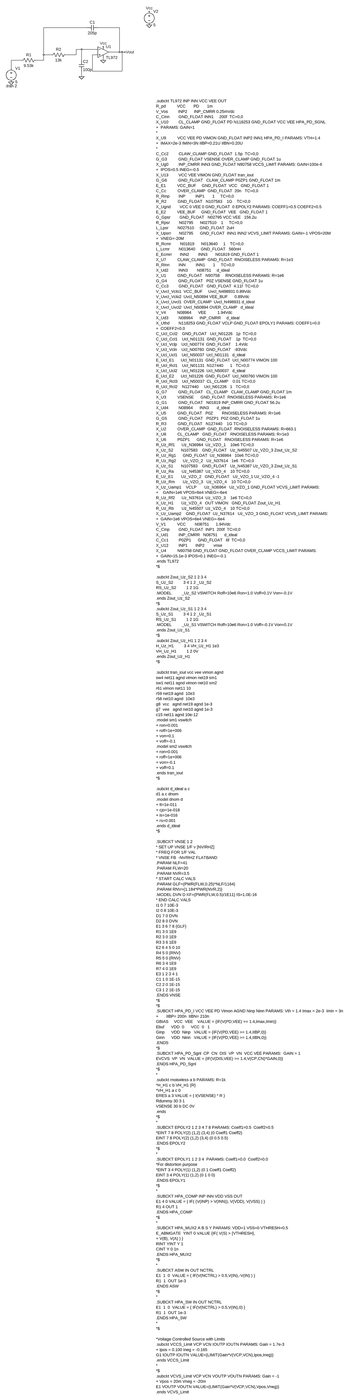
[diagram p0: schematic lowpass.asc, whole sheet]
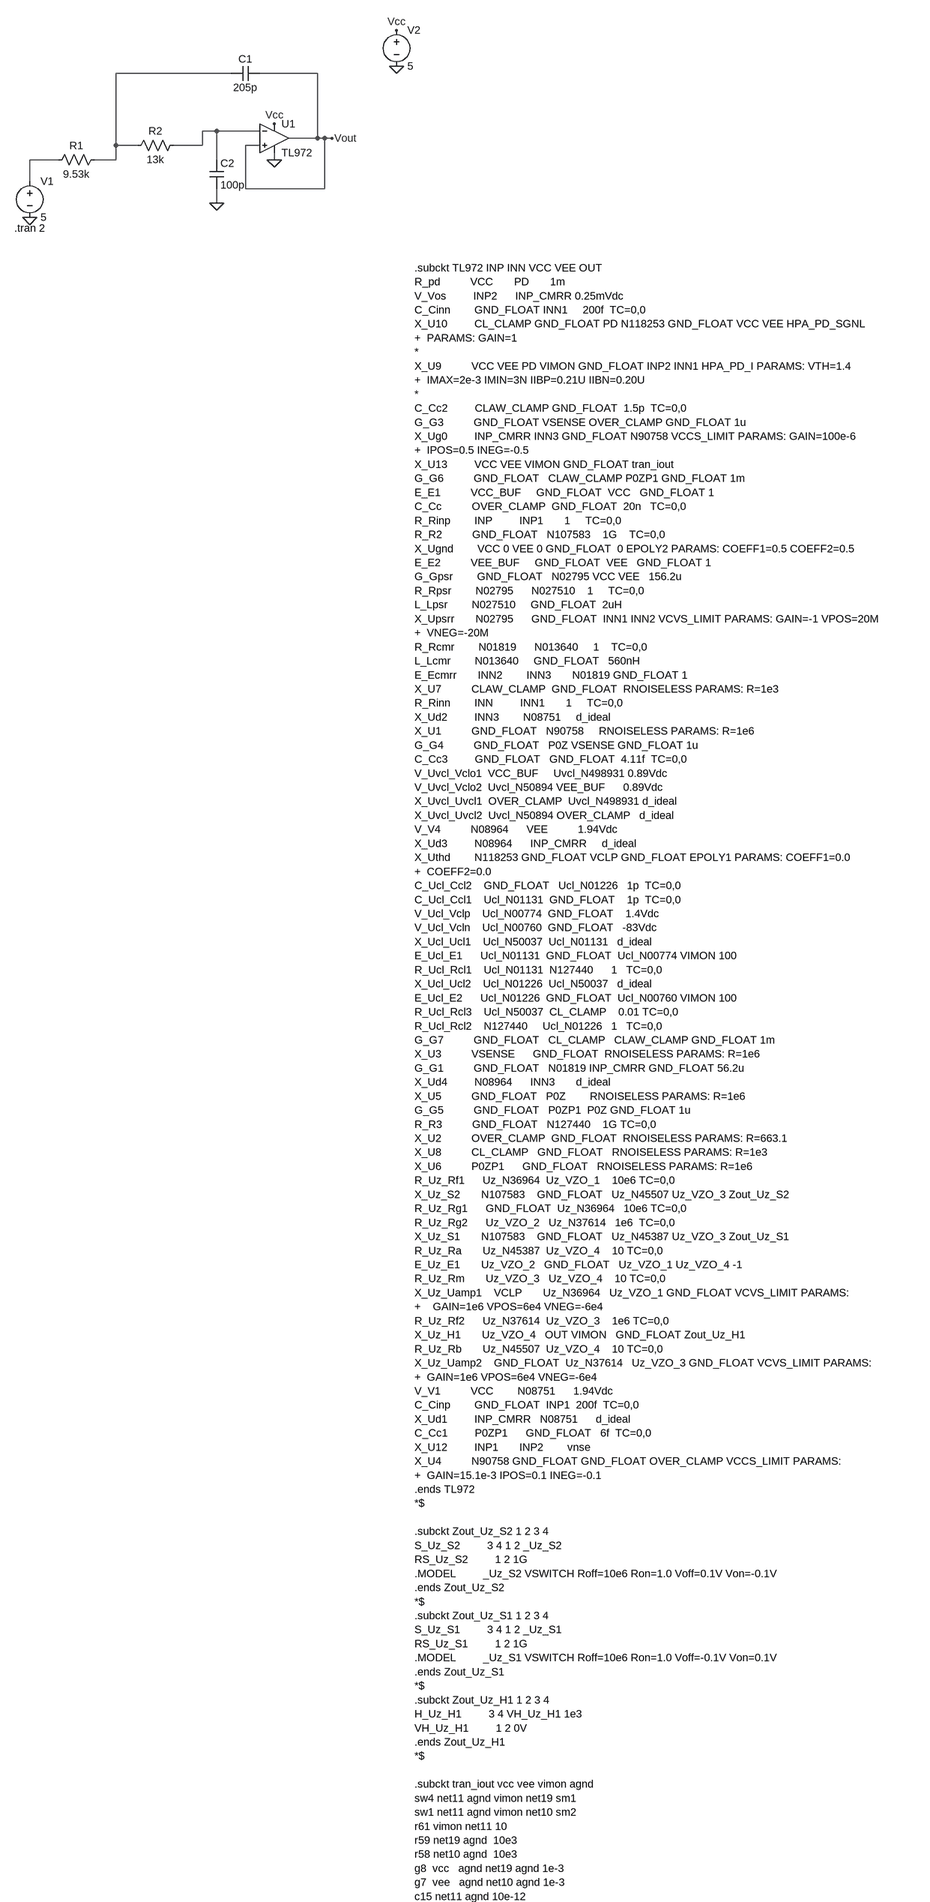
[diagram p1: schematic lowpass.asc, part, row 1 of 2, column 1 of 1]
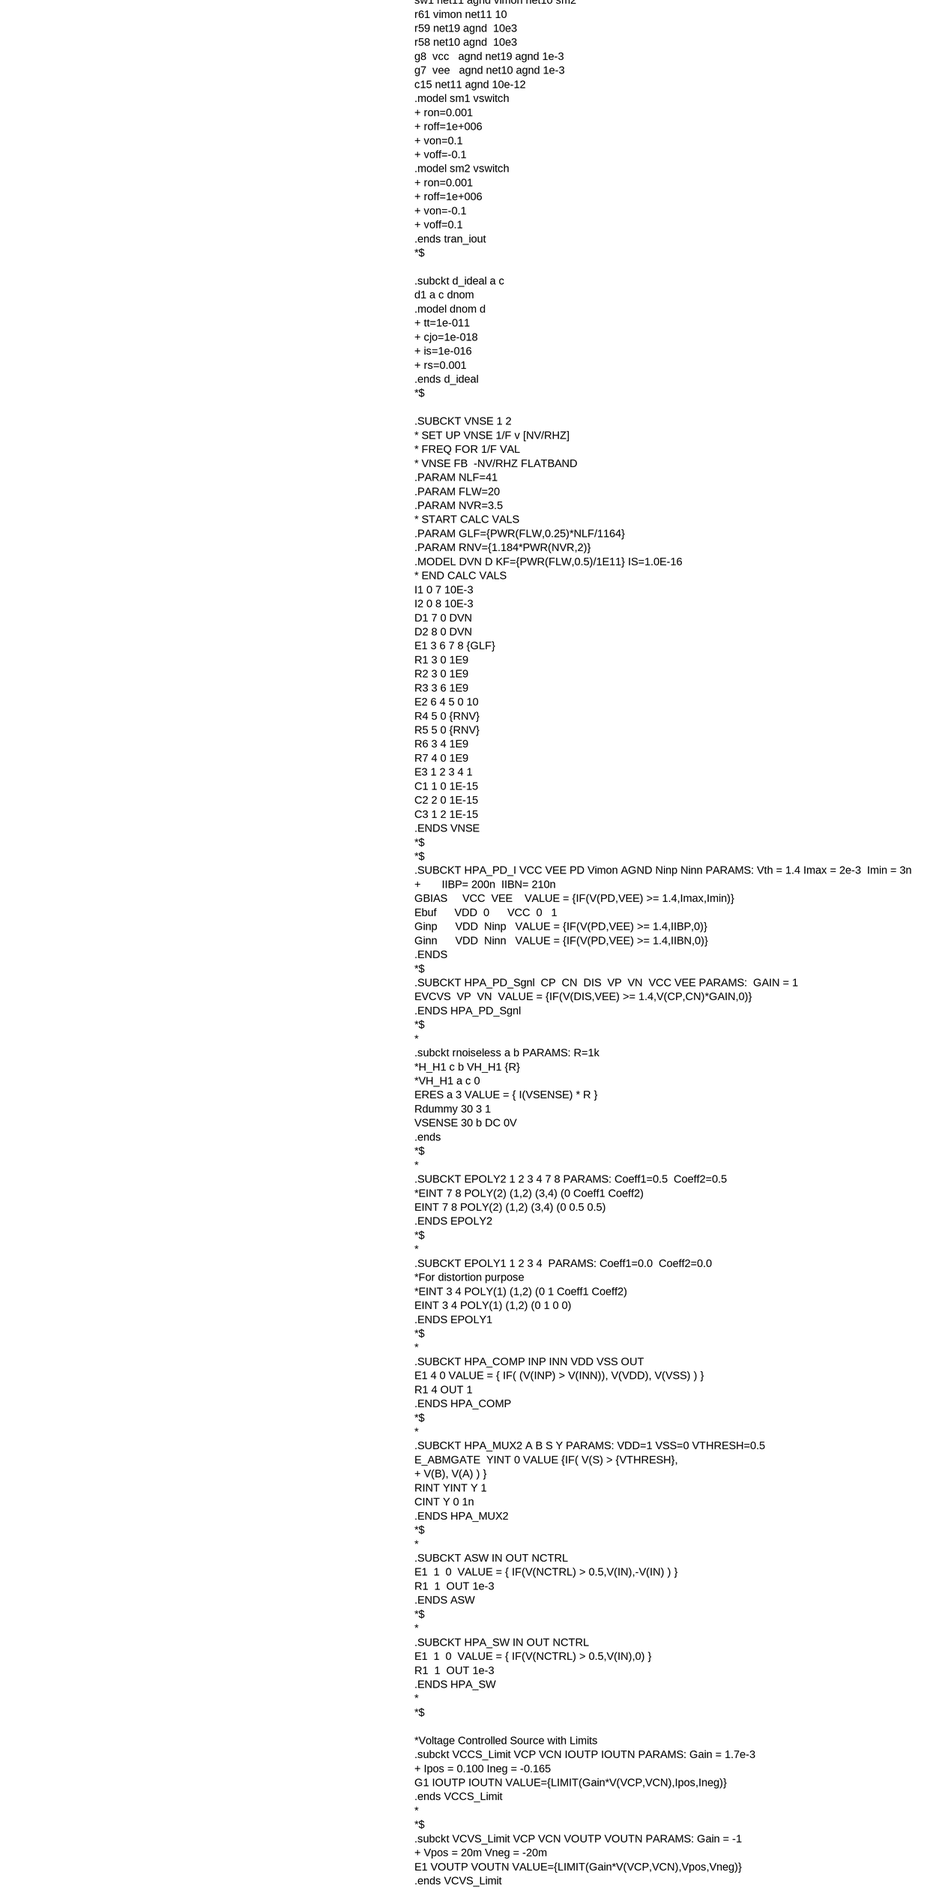
[diagram p2: schematic lowpass.asc, part, row 2 of 2, column 1 of 1]
lowpass.asc, the LTspice schematic file:
Version 4
SHEET 1 2088 7200
WIRE 512 -80 256 -80
WIRE 704 -80 576 -80
WIRE 480 48 448 48
WIRE 576 48 480 48
WIRE 704 64 704 -80
WIRE 704 64 640 64
WIRE 720 64 704 64
WIRE 736 64 720 64
WIRE 256 80 256 -80
WIRE 304 80 256 80
WIRE 448 80 448 48
WIRE 448 80 384 80
WIRE 576 80 544 80
WIRE 128 112 64 112
WIRE 256 112 256 80
WIRE 256 112 208 112
WIRE 480 112 480 48
WIRE 608 112 608 96
WIRE 64 160 64 112
WIRE 544 176 544 80
WIRE 720 176 720 64
WIRE 720 176 544 176
WIRE 480 208 480 176
FLAG 64 240 0
FLAG 480 208 0
FLAG 736 64 Vout
FLAG 608 32 Vcc
FLAG 608 112 0
FLAG 880 -176 Vcc
FLAG 880 -96 0
SYMBOL voltage 64 144 R0
WINDOW 123 0 0 Left 0
WINDOW 39 0 0 Left 0
SYMATTR InstName V1
SYMATTR Value 5
SYMBOL res 224 96 R90
WINDOW 0 0 56 VBottom 2
WINDOW 3 32 56 VTop 2
SYMATTR InstName R1
SYMATTR Value 9.53k
SYMBOL res 400 64 R90
WINDOW 0 0 56 VBottom 2
WINDOW 3 32 56 VTop 2
SYMATTR InstName R2
SYMATTR Value 13k
SYMBOL cap 576 -96 R90
WINDOW 0 0 32 VBottom 2
WINDOW 3 32 32 VTop 2
SYMATTR InstName C1
SYMATTR Value 205p
SYMBOL cap 464 112 R0
SYMATTR InstName C2
SYMATTR Value 100p
SYMBOL OpAmps\\opamp2 608 0 R0
SYMATTR InstName U1
SYMATTR Value TL972
SYMBOL voltage 880 -192 R0
WINDOW 123 0 0 Left 0
WINDOW 39 0 0 Left 0
SYMATTR InstName V2
SYMATTR Value 5
TEXT 30 264 Left 2 !.tran 2
TEXT 920 352 Left 2 !.subckt TL972 INP INN VCC VEE OUT\nR_pd          VCC       PD       1m  \nV_Vos         INP2      INP_CMRR 0.25mVdc\nC_Cinn        GND_FLOAT INN1     200f  TC=0,0 \nX_U10         CL_CLAMP GND_FLOAT PD N118253 GND_FLOAT VCC VEE HPA_PD_SGNL\n+  PARAMS: GAIN=1\n*\nX_U9          VCC VEE PD VIMON GND_FLOAT INP2 INN1 HPA_PD_I PARAMS: VTH=1.4\n+  IMAX=2e-3 IMIN=3N IIBP=0.21U IIBN=0.20U\n*\nC_Cc2         CLAW_CLAMP GND_FLOAT  1.5p  TC=0,0 \nG_G3          GND_FLOAT VSENSE OVER_CLAMP GND_FLOAT 1u\nX_Ug0         INP_CMRR INN3 GND_FLOAT N90758 VCCS_LIMIT PARAMS: GAIN=100e-6\n+  IPOS=0.5 INEG=-0.5\nX_U13         VCC VEE VIMON GND_FLOAT tran_iout \nG_G6          GND_FLOAT   CLAW_CLAMP P0ZP1 GND_FLOAT 1m\nE_E1          VCC_BUF     GND_FLOAT  VCC   GND_FLOAT 1\nC_Cc          OVER_CLAMP  GND_FLOAT  20n   TC=0,0 \nR_Rinp        INP         INP1       1     TC=0,0 \nR_R2          GND_FLOAT   N107583    1G    TC=0,0 \nX_Ugnd        VCC 0 VEE 0 GND_FLOAT  0 EPOLY2 PARAMS: COEFF1=0.5 COEFF2=0.5\nE_E2          VEE_BUF     GND_FLOAT  VEE   GND_FLOAT 1\nG_Gpsr        GND_FLOAT   N02795 VCC VEE   156.2u\nR_Rpsr        N02795      N027510    1     TC=0,0 \nL_Lpsr        N027510     GND_FLOAT  2uH  \nX_Upsrr       N02795      GND_FLOAT  INN1 INN2 VCVS_LIMIT PARAMS: GAIN=-1 VPOS=20M\n+  VNEG=-20M\nR_Rcmr        N01819      N013640     1    TC=0,0 \nL_Lcmr        N013640     GND_FLOAT   560nH  \nE_Ecmrr       INN2        INN3       N01819 GND_FLOAT 1\nX_U7          CLAW_CLAMP  GND_FLOAT  RNOISELESS PARAMS: R=1e3\nR_Rinn        INN         INN1       1     TC=0,0 \nX_Ud2         INN3        N08751     d_ideal \nX_U1          GND_FLOAT   N90758     RNOISELESS PARAMS: R=1e6\nG_G4          GND_FLOAT   P0Z VSENSE GND_FLOAT 1u\nC_Cc3         GND_FLOAT   GND_FLOAT  4.11f  TC=0,0 \nV_Uvcl_Vclo1  VCC_BUF     Uvcl_N498931 0.89Vdc\nV_Uvcl_Vclo2  Uvcl_N50894 VEE_BUF      0.89Vdc\nX_Uvcl_Uvcl1  OVER_CLAMP  Uvcl_N498931 d_ideal \nX_Uvcl_Uvcl2  Uvcl_N50894 OVER_CLAMP   d_ideal \nV_V4          N08964      VEE          1.94Vdc\nX_Ud3         N08964      INP_CMRR     d_ideal \nX_Uthd        N118253 GND_FLOAT VCLP GND_FLOAT EPOLY1 PARAMS: COEFF1=0.0\n+  COEFF2=0.0\nC_Ucl_Ccl2    GND_FLOAT   Ucl_N01226   1p  TC=0,0 \nC_Ucl_Ccl1    Ucl_N01131  GND_FLOAT    1p  TC=0,0 \nV_Ucl_Vclp    Ucl_N00774  GND_FLOAT    1.4Vdc\nV_Ucl_Vcln    Ucl_N00760  GND_FLOAT   -83Vdc\nX_Ucl_Ucl1    Ucl_N50037  Ucl_N01131   d_ideal \nE_Ucl_E1      Ucl_N01131  GND_FLOAT  Ucl_N00774 VIMON 100\nR_Ucl_Rcl1    Ucl_N01131  N127440      1   TC=0,0 \nX_Ucl_Ucl2    Ucl_N01226  Ucl_N50037   d_ideal \nE_Ucl_E2      Ucl_N01226  GND_FLOAT  Ucl_N00760 VIMON 100\nR_Ucl_Rcl3    Ucl_N50037  CL_CLAMP    0.01 TC=0,0 \nR_Ucl_Rcl2    N127440     Ucl_N01226   1   TC=0,0 \nG_G7          GND_FLOAT   CL_CLAMP   CLAW_CLAMP GND_FLOAT 1m\nX_U3          VSENSE      GND_FLOAT  RNOISELESS PARAMS: R=1e6\nG_G1          GND_FLOAT   N01819 INP_CMRR GND_FLOAT 56.2u\nX_Ud4         N08964      INN3       d_ideal \nX_U5          GND_FLOAT   P0Z        RNOISELESS PARAMS: R=1e6\nG_G5          GND_FLOAT   P0ZP1  P0Z GND_FLOAT 1u\nR_R3          GND_FLOAT   N127440    1G TC=0,0 \nX_U2          OVER_CLAMP  GND_FLOAT  RNOISELESS PARAMS: R=663.1\nX_U8          CL_CLAMP   GND_FLOAT   RNOISELESS PARAMS: R=1e3\nX_U6          P0ZP1      GND_FLOAT   RNOISELESS PARAMS: R=1e6\nR_Uz_Rf1      Uz_N36964  Uz_VZO_1    10e6 TC=0,0 \nX_Uz_S2       N107583    GND_FLOAT   Uz_N45507 Uz_VZO_3 Zout_Uz_S2 \nR_Uz_Rg1      GND_FLOAT  Uz_N36964   10e6 TC=0,0 \nR_Uz_Rg2      Uz_VZO_2   Uz_N37614   1e6  TC=0,0 \nX_Uz_S1       N107583    GND_FLOAT   Uz_N45387 Uz_VZO_3 Zout_Uz_S1 \nR_Uz_Ra       Uz_N45387  Uz_VZO_4    10 TC=0,0 \nE_Uz_E1       Uz_VZO_2   GND_FLOAT   Uz_VZO_1 Uz_VZO_4 -1\nR_Uz_Rm       Uz_VZO_3   Uz_VZO_4    10 TC=0,0 \nX_Uz_Uamp1    VCLP       Uz_N36964   Uz_VZO_1 GND_FLOAT VCVS_LIMIT PARAMS:\n+    GAIN=1e6 VPOS=6e4 VNEG=-6e4\nR_Uz_Rf2      Uz_N37614  Uz_VZO_3    1e6 TC=0,0 \nX_Uz_H1       Uz_VZO_4   OUT VIMON   GND_FLOAT Zout_Uz_H1 \nR_Uz_Rb       Uz_N45507  Uz_VZO_4    10 TC=0,0 \nX_Uz_Uamp2    GND_FLOAT  Uz_N37614   Uz_VZO_3 GND_FLOAT VCVS_LIMIT PARAMS:\n+  GAIN=1e6 VPOS=6e4 VNEG=-6e4\nV_V1          VCC        N08751      1.94Vdc\nC_Cinp        GND_FLOAT  INP1  200f  TC=0,0 \nX_Ud1         INP_CMRR   N08751      d_ideal \nC_Cc1         P0ZP1      GND_FLOAT   6f  TC=0,0 \nX_U12         INP1       INP2        vnse \nX_U4          N90758 GND_FLOAT GND_FLOAT OVER_CLAMP VCCS_LIMIT PARAMS:\n+  GAIN=15.1e-3 IPOS=0.1 INEG=-0.1\n.ends TL972\n*$\n \n.subckt Zout_Uz_S2 1 2 3 4  \nS_Uz_S2         3 4 1 2 _Uz_S2\nRS_Uz_S2         1 2 1G\n.MODEL         _Uz_S2 VSWITCH Roff=10e6 Ron=1.0 Voff=0.1V Von=-0.1V\n.ends Zout_Uz_S2\n*$\n.subckt Zout_Uz_S1 1 2 3 4  \nS_Uz_S1         3 4 1 2 _Uz_S1\nRS_Uz_S1         1 2 1G\n.MODEL         _Uz_S1 VSWITCH Roff=10e6 Ron=1.0 Voff=-0.1V Von=0.1V\n.ends Zout_Uz_S1\n*$\n.subckt Zout_Uz_H1 1 2 3 4  \nH_Uz_H1         3 4 VH_Uz_H1 1e3\nVH_Uz_H1         1 2 0V\n.ends Zout_Uz_H1\n*$\n \n.subckt tran_iout vcc vee vimon agnd \nsw4 net11 agnd vimon net19 sm1 \nsw1 net11 agnd vimon net10 sm2 \nr61 vimon net11 10 \nr59 net19 agnd  10e3 \nr58 net10 agnd  10e3 \ng8  vcc   agnd net19 agnd 1e-3\ng7  vee   agnd net10 agnd 1e-3\nc15 net11 agnd 10e-12\n.model sm1 vswitch\n+ ron=0.001\n+ roff=1e+006\n+ von=0.1\n+ voff=-0.1\n.model sm2 vswitch\n+ ron=0.001\n+ roff=1e+006\n+ von=-0.1\n+ voff=0.1\n.ends tran_iout\n*$\n \n.subckt d_ideal a c\nd1 a c dnom\n.model dnom d\n+ tt=1e-011\n+ cjo=1e-018\n+ is=1e-016\n+ rs=0.001\n.ends d_ideal\n*$\n \n.SUBCKT VNSE 1 2\n* SET UP VNSE 1/F v [NV/RHZ]\n* FREQ FOR 1/F VAL\n* VNSE FB  -NV/RHZ FLATBAND\n.PARAM NLF=41\n.PARAM FLW=20\n.PARAM NVR=3.5\n* START CALC VALS\n.PARAM GLF={PWR(FLW,0.25)*NLF/1164}\n.PARAM RNV={1.184*PWR(NVR,2)}\n.MODEL DVN D KF={PWR(FLW,0.5)/1E11} IS=1.0E-16\n* END CALC VALS\nI1 0 7 10E-3\nI2 0 8 10E-3\nD1 7 0 DVN\nD2 8 0 DVN\nE1 3 6 7 8 {GLF}\nR1 3 0 1E9\nR2 3 0 1E9\nR3 3 6 1E9\nE2 6 4 5 0 10\nR4 5 0 {RNV}\nR5 5 0 {RNV}\nR6 3 4 1E9\nR7 4 0 1E9\nE3 1 2 3 4 1\nC1 1 0 1E-15\nC2 2 0 1E-15\nC3 1 2 1E-15\n.ENDS VNSE\n*$\n*$\n.SUBCKT HPA_PD_I VCC VEE PD Vimon AGND Ninp Ninn PARAMS: Vth = 1.4 Imax = 2e-3  Imin = 3n \n+       IIBP= 200n  IIBN= 210n\nGBIAS     VCC  VEE    VALUE = {IF(V(PD,VEE) >= 1.4,Imax,Imin)}\nEbuf      VDD  0      VCC  0   1\nGinp      VDD  Ninp   VALUE = {IF(V(PD,VEE) >= 1.4,IIBP,0)}\nGinn      VDD  Ninn   VALUE = {IF(V(PD,VEE) >= 1.4,IIBN,0)}\n.ENDS\n*$\n.SUBCKT HPA_PD_Sgnl  CP  CN  DIS  VP  VN  VCC VEE PARAMS:  GAIN = 1\nEVCVS  VP  VN  VALUE = {IF(V(DIS,VEE) >= 1.4,V(CP,CN)*GAIN,0)}\n.ENDS HPA_PD_Sgnl\n*$\n*\n.subckt rnoiseless a b PARAMS: R=1k\n*H_H1 c b VH_H1 {R}\n*VH_H1 a c 0\nERES a 3 VALUE = { I(VSENSE) * R }\nRdummy 30 3 1\nVSENSE 30 b DC 0V\n.ends\n*$\n*\n.SUBCKT EPOLY2 1 2 3 4 7 8 PARAMS: Coeff1=0.5  Coeff2=0.5\n*EINT 7 8 POLY(2) (1,2) (3,4) (0 Coeff1 Coeff2)\nEINT 7 8 POLY(2) (1,2) (3,4) (0 0.5 0.5)\n.ENDS EPOLY2 \n*$\n*\n.SUBCKT EPOLY1 1 2 3 4  PARAMS: Coeff1=0.0  Coeff2=0.0\n*For distortion purpose\n*EINT 3 4 POLY(1) (1,2) (0 1 Coeff1 Coeff2)\nEINT 3 4 POLY(1) (1,2) (0 1 0 0)\n.ENDS EPOLY1 \n*$\n*\n.SUBCKT HPA_COMP INP INN VDD VSS OUT \nE1 4 0 VALUE = { IF( (V(INP) > V(INN)), V(VDD), V(VSS) ) }\nR1 4 OUT 1\n.ENDS HPA_COMP\n*$\n*\n.SUBCKT HPA_MUX2 A B S Y PARAMS: VDD=1 VSS=0 VTHRESH=0.5 \nE_ABMGATE  YINT 0 VALUE {IF( V(S) > {VTHRESH},  \n+ V(B), V(A) ) }\nRINT YINT Y 1\nCINT Y 0 1n\n.ENDS HPA_MUX2\n*$\n*\n.SUBCKT ASW IN OUT NCTRL\nE1  1  0  VALUE = { IF(V(NCTRL) > 0.5,V(IN),-V(IN) ) }\nR1  1  OUT 1e-3\n.ENDS ASW\n*$\n*\n.SUBCKT HPA_SW IN OUT NCTRL\nE1  1  0  VALUE = { IF(V(NCTRL) > 0.5,V(IN),0) }\nR1  1  OUT 1e-3\n.ENDS HPA_SW\n*\n*$\n \n*Voltage Controlled Source with Limits\n.subckt VCCS_Limit VCP VCN IOUTP IOUTN PARAMS: Gain = 1.7e-3\n+ Ipos = 0.100 Ineg = -0.165\nG1 IOUTP IOUTN VALUE={LIMIT(Gain*V(VCP,VCN),Ipos,Ineg)}\n.ends VCCS_Limit\n*\n*$\n.subckt VCVS_Limit VCP VCN VOUTP VOUTN PARAMS: Gain = -1\n+ Vpos = 20m Vneg = -20m\nE1 VOUTP VOUTN VALUE={LIMIT(Gain*V(VCP,VCN),Vpos,Vneg)}\n.ends VCVS_Limit

The netlist it stands for:
* lowpass.asc
V1 N003 0 5
R1 N001 N003 9.53k
R2 N002 N001 13k
C1 Vout N001 205p
C2 N002 0 100p
XU1 Vout N002 Vcc 0 Vout TL972  ; pins In+ In- V+ V- OUT
V2 Vcc 0 5
.tran 2
.subckt TL972 INP INN VCC VEE OUT
R_pd          VCC       PD       1m
V_Vos         INP2      INP_CMRR 0.25mVdc
C_Cinn        GND_FLOAT INN1     200f  TC=0,0
X_U10         CL_CLAMP GND_FLOAT PD N118253 GND_FLOAT VCC VEE HPA_PD_SGNL
+  PARAMS: GAIN=1
*
X_U9          VCC VEE PD VIMON GND_FLOAT INP2 INN1 HPA_PD_I PARAMS: VTH=1.4
+  IMAX=2e-3 IMIN=3N IIBP=0.21U IIBN=0.20U
*
C_Cc2         CLAW_CLAMP GND_FLOAT  1.5p  TC=0,0
G_G3          GND_FLOAT VSENSE OVER_CLAMP GND_FLOAT 1u
X_Ug0         INP_CMRR INN3 GND_FLOAT N90758 VCCS_LIMIT PARAMS: GAIN=100e-6
+  IPOS=0.5 INEG=-0.5
X_U13         VCC VEE VIMON GND_FLOAT tran_iout
G_G6          GND_FLOAT   CLAW_CLAMP P0ZP1 GND_FLOAT 1m
E_E1          VCC_BUF     GND_FLOAT  VCC   GND_FLOAT 1
C_Cc          OVER_CLAMP  GND_FLOAT  20n   TC=0,0
R_Rinp        INP         INP1       1     TC=0,0
R_R2          GND_FLOAT   N107583    1G    TC=0,0
X_Ugnd        VCC 0 VEE 0 GND_FLOAT  0 EPOLY2 PARAMS: COEFF1=0.5 COEFF2=0.5
E_E2          VEE_BUF     GND_FLOAT  VEE   GND_FLOAT 1
G_Gpsr        GND_FLOAT   N02795 VCC VEE   156.2u
R_Rpsr        N02795      N027510    1     TC=0,0
L_Lpsr        N027510     GND_FLOAT  2uH
X_Upsrr       N02795      GND_FLOAT  INN1 INN2 VCVS_LIMIT PARAMS: GAIN=-1 VPOS=20M
+  VNEG=-20M
R_Rcmr        N01819      N013640     1    TC=0,0
L_Lcmr        N013640     GND_FLOAT   560nH
E_Ecmrr       INN2        INN3       N01819 GND_FLOAT 1
X_U7          CLAW_CLAMP  GND_FLOAT  RNOISELESS PARAMS: R=1e3
R_Rinn        INN         INN1       1     TC=0,0
X_Ud2         INN3        N08751     d_ideal
X_U1          GND_FLOAT   N90758     RNOISELESS PARAMS: R=1e6
G_G4          GND_FLOAT   P0Z VSENSE GND_FLOAT 1u
C_Cc3         GND_FLOAT   GND_FLOAT  4.11f  TC=0,0
V_Uvcl_Vclo1  VCC_BUF     Uvcl_N498931 0.89Vdc
V_Uvcl_Vclo2  Uvcl_N50894 VEE_BUF      0.89Vdc
X_Uvcl_Uvcl1  OVER_CLAMP  Uvcl_N498931 d_ideal
X_Uvcl_Uvcl2  Uvcl_N50894 OVER_CLAMP   d_ideal
V_V4          N08964      VEE          1.94Vdc
X_Ud3         N08964      INP_CMRR     d_ideal
X_Uthd        N118253 GND_FLOAT VCLP GND_FLOAT EPOLY1 PARAMS: COEFF1=0.0
+  COEFF2=0.0
C_Ucl_Ccl2    GND_FLOAT   Ucl_N01226   1p  TC=0,0
C_Ucl_Ccl1    Ucl_N01131  GND_FLOAT    1p  TC=0,0
V_Ucl_Vclp    Ucl_N00774  GND_FLOAT    1.4Vdc
V_Ucl_Vcln    Ucl_N00760  GND_FLOAT   -83Vdc
X_Ucl_Ucl1    Ucl_N50037  Ucl_N01131   d_ideal
E_Ucl_E1      Ucl_N01131  GND_FLOAT  Ucl_N00774 VIMON 100
R_Ucl_Rcl1    Ucl_N01131  N127440      1   TC=0,0
X_Ucl_Ucl2    Ucl_N01226  Ucl_N50037   d_ideal
E_Ucl_E2      Ucl_N01226  GND_FLOAT  Ucl_N00760 VIMON 100
R_Ucl_Rcl3    Ucl_N50037  CL_CLAMP    0.01 TC=0,0
R_Ucl_Rcl2    N127440     Ucl_N01226   1   TC=0,0
G_G7          GND_FLOAT   CL_CLAMP   CLAW_CLAMP GND_FLOAT 1m
X_U3          VSENSE      GND_FLOAT  RNOISELESS PARAMS: R=1e6
G_G1          GND_FLOAT   N01819 INP_CMRR GND_FLOAT 56.2u
X_Ud4         N08964      INN3       d_ideal
X_U5          GND_FLOAT   P0Z        RNOISELESS PARAMS: R=1e6
G_G5          GND_FLOAT   P0ZP1  P0Z GND_FLOAT 1u
R_R3          GND_FLOAT   N127440    1G TC=0,0
X_U2          OVER_CLAMP  GND_FLOAT  RNOISELESS PARAMS: R=663.1
X_U8          CL_CLAMP   GND_FLOAT   RNOISELESS PARAMS: R=1e3
X_U6          P0ZP1      GND_FLOAT   RNOISELESS PARAMS: R=1e6
R_Uz_Rf1      Uz_N36964  Uz_VZO_1    10e6 TC=0,0
X_Uz_S2       N107583    GND_FLOAT   Uz_N45507 Uz_VZO_3 Zout_Uz_S2
R_Uz_Rg1      GND_FLOAT  Uz_N36964   10e6 TC=0,0
R_Uz_Rg2      Uz_VZO_2   Uz_N37614   1e6  TC=0,0
X_Uz_S1       N107583    GND_FLOAT   Uz_N45387 Uz_VZO_3 Zout_Uz_S1
R_Uz_Ra       Uz_N45387  Uz_VZO_4    10 TC=0,0
E_Uz_E1       Uz_VZO_2   GND_FLOAT   Uz_VZO_1 Uz_VZO_4 -1
R_Uz_Rm       Uz_VZO_3   Uz_VZO_4    10 TC=0,0
X_Uz_Uamp1    VCLP       Uz_N36964   Uz_VZO_1 GND_FLOAT VCVS_LIMIT PARAMS:
+    GAIN=1e6 VPOS=6e4 VNEG=-6e4
R_Uz_Rf2      Uz_N37614  Uz_VZO_3    1e6 TC=0,0
X_Uz_H1       Uz_VZO_4   OUT VIMON   GND_FLOAT Zout_Uz_H1
R_Uz_Rb       Uz_N45507  Uz_VZO_4    10 TC=0,0
X_Uz_Uamp2    GND_FLOAT  Uz_N37614   Uz_VZO_3 GND_FLOAT VCVS_LIMIT PARAMS:
+  GAIN=1e6 VPOS=6e4 VNEG=-6e4
V_V1          VCC        N08751      1.94Vdc
C_Cinp        GND_FLOAT  INP1  200f  TC=0,0
X_Ud1         INP_CMRR   N08751      d_ideal
C_Cc1         P0ZP1      GND_FLOAT   6f  TC=0,0
X_U12         INP1       INP2        vnse
X_U4          N90758 GND_FLOAT GND_FLOAT OVER_CLAMP VCCS_LIMIT PARAMS:
+  GAIN=15.1e-3 IPOS=0.1 INEG=-0.1
.ends TL972
*$
.subckt Zout_Uz_S2 1 2 3 4
S_Uz_S2         3 4 1 2 _Uz_S2
RS_Uz_S2         1 2 1G
.MODEL         _Uz_S2 VSWITCH Roff=10e6 Ron=1.0 Voff=0.1V Von=-0.1V
.ends Zout_Uz_S2
*$
.subckt Zout_Uz_S1 1 2 3 4
S_Uz_S1         3 4 1 2 _Uz_S1
RS_Uz_S1         1 2 1G
.MODEL         _Uz_S1 VSWITCH Roff=10e6 Ron=1.0 Voff=-0.1V Von=0.1V
.ends Zout_Uz_S1
*$
.subckt Zout_Uz_H1 1 2 3 4
H_Uz_H1         3 4 VH_Uz_H1 1e3
VH_Uz_H1         1 2 0V
.ends Zout_Uz_H1
*$
.subckt tran_iout vcc vee vimon agnd
sw4 net11 agnd vimon net19 sm1
sw1 net11 agnd vimon net10 sm2
r61 vimon net11 10
r59 net19 agnd  10e3
r58 net10 agnd  10e3
g8  vcc   agnd net19 agnd 1e-3
g7  vee   agnd net10 agnd 1e-3
c15 net11 agnd 10e-12
.model sm1 vswitch
+ ron=0.001
+ roff=1e+006
+ von=0.1
+ voff=-0.1
.model sm2 vswitch
+ ron=0.001
+ roff=1e+006
+ von=-0.1
+ voff=0.1
.ends tran_iout
*$
.subckt d_ideal a c
d1 a c dnom
.model dnom d
+ tt=1e-011
+ cjo=1e-018
+ is=1e-016
+ rs=0.001
.ends d_ideal
*$
.SUBCKT VNSE 1 2
* SET UP VNSE 1/F v [NV/RHZ]
* FREQ FOR 1/F VAL
* VNSE FB  -NV/RHZ FLATBAND
.PARAM NLF=41
.PARAM FLW=20
.PARAM NVR=3.5
* START CALC VALS
.PARAM GLF={PWR(FLW,0.25)*NLF/1164}
.PARAM RNV={1.184*PWR(NVR,2)}
.MODEL DVN D KF={PWR(FLW,0.5)/1E11} IS=1.0E-16
* END CALC VALS
I1 0 7 10E-3
I2 0 8 10E-3
D1 7 0 DVN
D2 8 0 DVN
E1 3 6 7 8 {GLF}
R1 3 0 1E9
R2 3 0 1E9
R3 3 6 1E9
E2 6 4 5 0 10
R4 5 0 {RNV}
R5 5 0 {RNV}
R6 3 4 1E9
R7 4 0 1E9
E3 1 2 3 4 1
C1 1 0 1E-15
C2 2 0 1E-15
C3 1 2 1E-15
.ENDS VNSE
*$
*$
.SUBCKT HPA_PD_I VCC VEE PD Vimon AGND Ninp Ninn PARAMS: Vth = 1.4 Imax = 2e-3  Imin = 3n
+       IIBP= 200n  IIBN= 210n
GBIAS     VCC  VEE    VALUE = {IF(V(PD,VEE) >= 1.4,Imax,Imin)}
Ebuf      VDD  0      VCC  0   1
Ginp      VDD  Ninp   VALUE = {IF(V(PD,VEE) >= 1.4,IIBP,0)}
Ginn      VDD  Ninn   VALUE = {IF(V(PD,VEE) >= 1.4,IIBN,0)}
.ENDS
*$
.SUBCKT HPA_PD_Sgnl  CP  CN  DIS  VP  VN  VCC VEE PARAMS:  GAIN = 1
EVCVS  VP  VN  VALUE = {IF(V(DIS,VEE) >= 1.4,V(CP,CN)*GAIN,0)}
.ENDS HPA_PD_Sgnl
*$
*
.subckt rnoiseless a b PARAMS: R=1k
*H_H1 c b VH_H1 {R}
*VH_H1 a c 0
ERES a 3 VALUE = { I(VSENSE) * R }
Rdummy 30 3 1
VSENSE 30 b DC 0V
.ends
*$
*
.SUBCKT EPOLY2 1 2 3 4 7 8 PARAMS: Coeff1=0.5  Coeff2=0.5
*EINT 7 8 POLY(2) (1,2) (3,4) (0 Coeff1 Coeff2)
EINT 7 8 POLY(2) (1,2) (3,4) (0 0.5 0.5)
.ENDS EPOLY2
*$
*
.SUBCKT EPOLY1 1 2 3 4  PARAMS: Coeff1=0.0  Coeff2=0.0
*For distortion purpose
*EINT 3 4 POLY(1) (1,2) (0 1 Coeff1 Coeff2)
EINT 3 4 POLY(1) (1,2) (0 1 0 0)
.ENDS EPOLY1
*$
*
.SUBCKT HPA_COMP INP INN VDD VSS OUT
E1 4 0 VALUE = { IF( (V(INP) > V(INN)), V(VDD), V(VSS) ) }
R1 4 OUT 1
.ENDS HPA_COMP
*$
*
.SUBCKT HPA_MUX2 A B S Y PARAMS: VDD=1 VSS=0 VTHRESH=0.5
E_ABMGATE  YINT 0 VALUE {IF( V(S) > {VTHRESH},
+ V(B), V(A) ) }
RINT YINT Y 1
CINT Y 0 1n
.ENDS HPA_MUX2
*$
*
.SUBCKT ASW IN OUT NCTRL
E1  1  0  VALUE = { IF(V(NCTRL) > 0.5,V(IN),-V(IN) ) }
R1  1  OUT 1e-3
.ENDS ASW
*$
*
.SUBCKT HPA_SW IN OUT NCTRL
E1  1  0  VALUE = { IF(V(NCTRL) > 0.5,V(IN),0) }
R1  1  OUT 1e-3
.ENDS HPA_SW
*
*$
*Voltage Controlled Source with Limits
.subckt VCCS_Limit VCP VCN IOUTP IOUTN PARAMS: Gain = 1.7e-3
+ Ipos = 0.100 Ineg = -0.165
G1 IOUTP IOUTN VALUE={LIMIT(Gain*V(VCP,VCN),Ipos,Ineg)}
.ends VCCS_Limit
*
*$
.subckt VCVS_Limit VCP VCN VOUTP VOUTN PARAMS: Gain = -1
+ Vpos = 20m Vneg = -20m
E1 VOUTP VOUTN VALUE={LIMIT(Gain*V(VCP,VCN),Vpos,Vneg)}
.ends VCVS_Limit
.backanno
.end